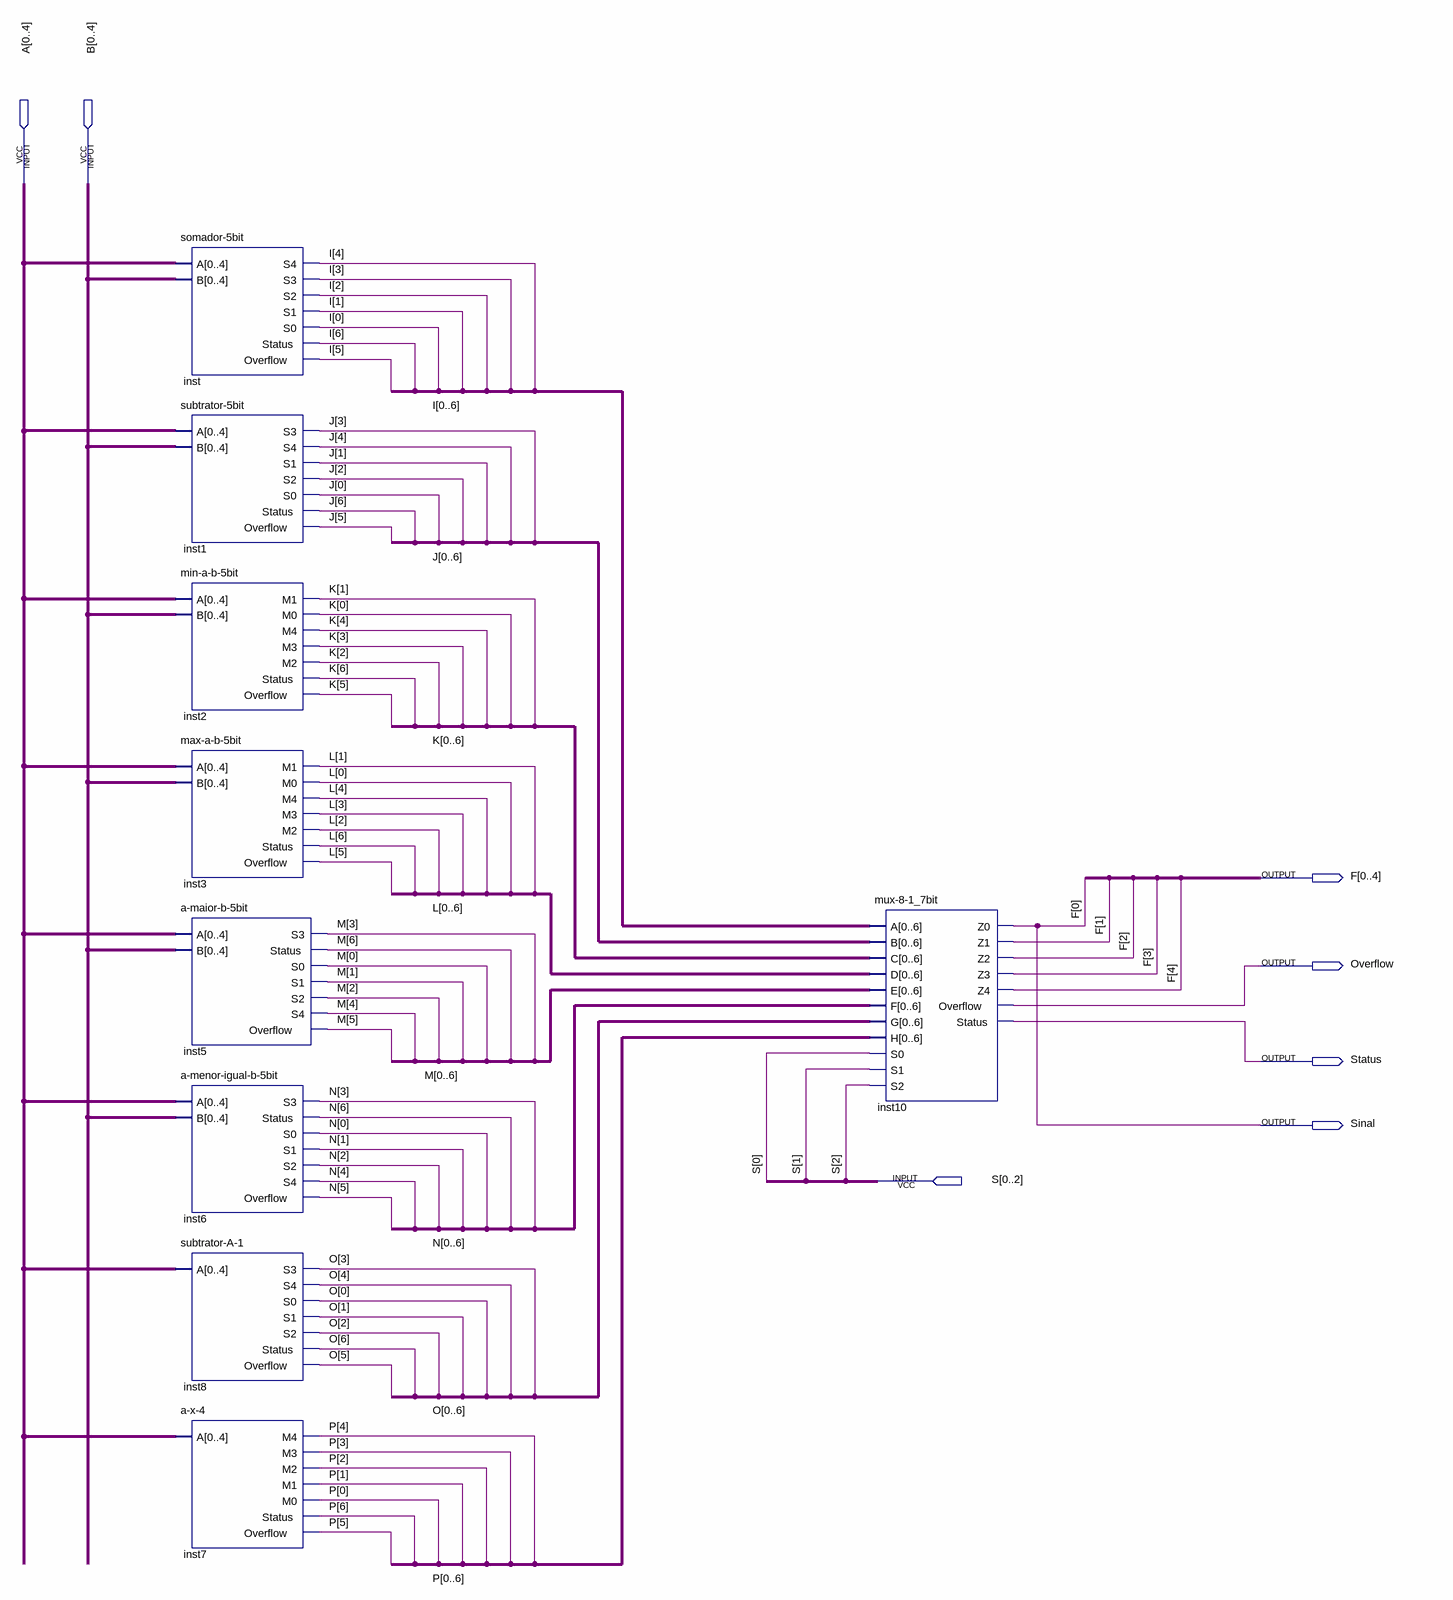
[diagram p0: schematic sheet]
// Quartus schematic unidade-logica-aritmetica.bdf as structural Verilog: 9 symbols, 7 pins
module \unidade-logica-aritmetica  (
  input  [0:4] A,
  input  [0:4] B,
  input  [0:2] S,
  output [0:4] F,
  output Overflow,
  output Status,
  output Sinal
);

  wire [6:0] I, J, K, L, M, N, O, P;

  \somador-5bit  inst (
    .A(A), .B(B), .S4(I[4]), .S3(I[3]), .S2(I[2]), .S1(I[1]), .S0(I[0]), .Status(I[6]), .Overflow(I[5]));
  \subtrator-5bit  inst1 (
    .A(A), .B(B), .S3(J[3]), .S4(J[4]), .S1(J[1]), .S2(J[2]), .S0(J[0]), .Status(J[6]), .Overflow(J[5]));
  \min-a-b-5bit  inst2 (
    .A(A), .B(B), .M1(K[1]), .M0(K[0]), .M4(K[4]), .M3(K[3]), .M2(K[2]), .Status(K[6]), .Overflow(K[5]));
  \max-a-b-5bit  inst3 (
    .A(A), .B(B), .M1(L[1]), .M0(L[0]), .M4(L[4]), .M3(L[3]), .M2(L[2]), .Status(L[6]), .Overflow(L[5]));
  \a-maior-b-5bit  inst5 (
    .A(A), .B(B), .S3(M[3]), .Status(M[6]), .S0(M[0]), .S1(M[1]), .S2(M[2]), .S4(M[4]), .Overflow(M[5]));
  \a-menor-igual-b-5bit  inst6 (
    .A(A), .B(B), .S3(N[3]), .Status(N[6]), .S0(N[0]), .S1(N[1]), .S2(N[2]), .S4(N[4]), .Overflow(N[5]));
  \subtrator-A-1  inst8 (.A(A), .S3(O[3]), .S4(O[4]), .S0(O[0]), .S1(O[1]), .S2(O[2]), .Status(O[6]), .Overflow(O[5]));
  \a-x-4  inst7 (.A(A), .M4(P[4]), .M3(P[3]), .M2(P[2]), .M1(P[1]), .M0(P[0]), .Status(P[6]), .Overflow(P[5]));
  \mux-8-1_7bit  inst10 (
    .A({I[0], I[1], I[2], I[3], I[4], I[5], I[6]}), .B({J[0], J[1], J[2], J[3], J[4], J[5], J[6]}),
    .C({K[0], K[1], K[2], K[3], K[4], K[5], K[6]}), .D({L[0], L[1], L[2], L[3], L[4], L[5], L[6]}),
    .E({M[0], M[1], M[2], M[3], M[4], M[5], M[6]}), .F({N[0], N[1], N[2], N[3], N[4], N[5], N[6]}),
    .G({O[0], O[1], O[2], O[3], O[4], O[5], O[6]}), .H({P[0], P[1], P[2], P[3], P[4], P[5], P[6]}),
    .S0(S[0]), .S1(S[1]), .S2(S[2]), .Z0(F[0]), .Z1(F[1]), .Z2(F[2]), .Z3(F[3]), .Z4(F[4]),
    .Overflow(Overflow), .Status(Status));

  assign Sinal = F[0];
endmodule
